# Altium schematic sheet CAN Transceiver.SchDoc
size A4; SheetNumber: 2; SheetTotal: 2
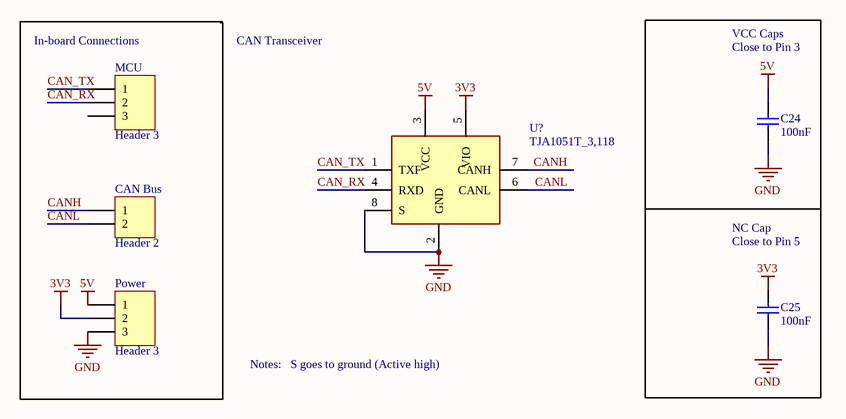
[diagram p0: CAN Transceiver.SchDoc]

## Parts
C24  value 100nF  [0805 - Capacitor]  (hidden comment: Capacitor - Nonpolarized)
C25  value 100nF  [0805 - Capacitor]  (hidden comment: Capacitor - Nonpolarized)
CAN_Bus  Header 2  [HDR1X2]
MCU  Header 3  [HDR1X3]
Power  Header 3  [HDR1X3]
U?  TJA1051T_3,118  [TJA1051T/3,118]

## Nets
3V3: C25.2 Power.2 U?.5(VIO)
5V: C24.2 Power.1 U?.3(VCC)
GND: C24.1 C25.1 Power.3 U?.2(GND) U?.8(S)
CAN_RX: MCU.2 U?.4(RXD)
CAN_TX: MCU.1 U?.1(TXF)
CANH: CAN_Bus.1 U?.7(CANH)
CANL: CAN_Bus.2 U?.6(CANL)

Not connected (* = marked no-connect by the designer): MCU 3

## Notes on the sheet
- (near MCU) In-board Connections
- CAN Transceiver
- VCC Caps
- Close to Pin 3
- NC Cap
- Close to Pin 5
- Notes:
- S goes to ground (Active high)

## Library data of the parts
C24 C25 = Capacitor - Nonpolarized: Nonpolarized Capacitor; Supplier Part Number: 311-3420-1-ND; Supplier: *; Manufacturer: *; Rating: *; Manufacturer Part Number: *
CAN_Bus = Header 2: Header, 2-Pin; LatestRevisionDate: 17-Jul-2002; LatestRevisionNote: Re-released for DXP Platform.; Publisher: Altium Limited
MCU Power = Header 3: Header, 3-Pin; LatestRevisionDate: 17-Jul-2002; LatestRevisionNote: Re-released for DXP Platform.; Publisher: Altium Limited
U? = TJA1051T_3,118: CAN Transceiver IC 4.5V-5.5V 250ns; Manufacturer: NXP; Manufacturer Part Number: TJA1051T/3,118; Supplier Part Number: 568-8684-1-ND; Supplier: Digikey; ComponentLink1Description: Datasheet; ComponentLink1URL: http://www.nxp.com/docs/en/data-sheet/TJA1051.pdf